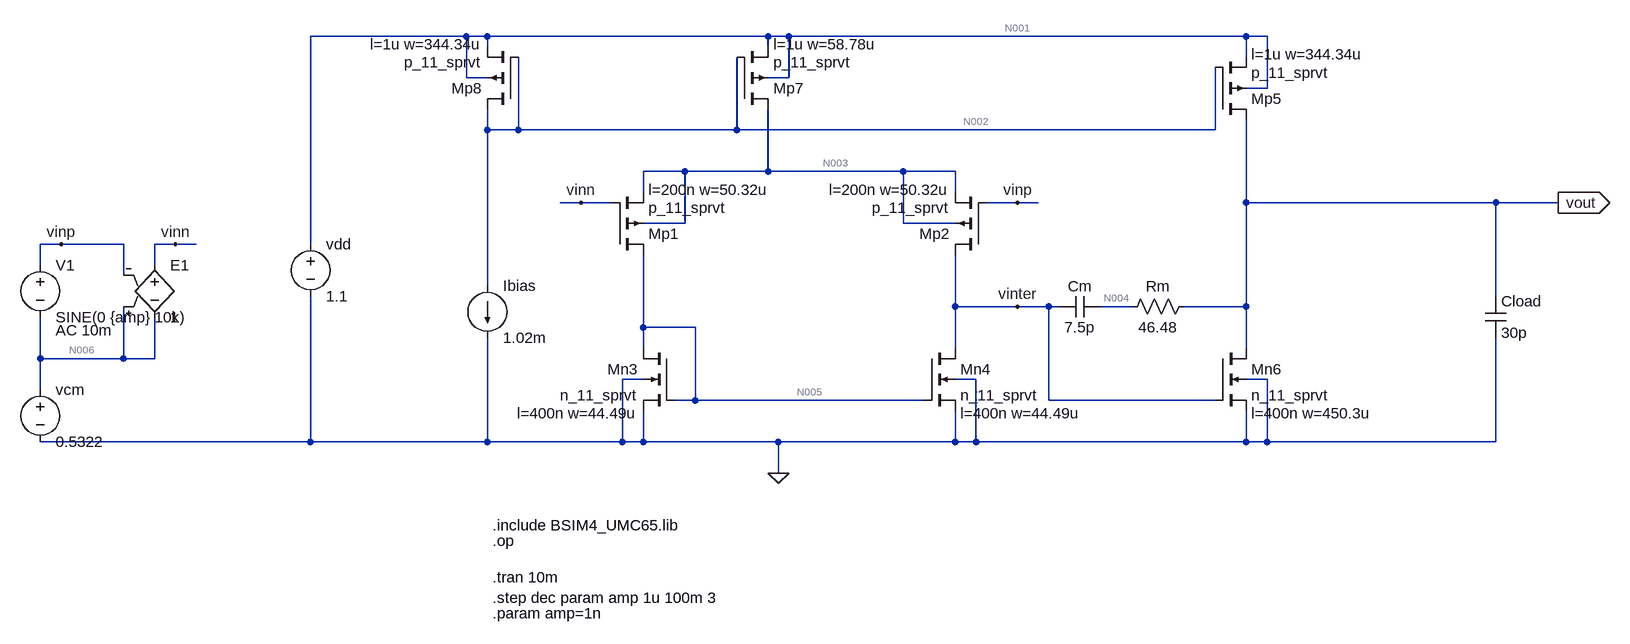
[diagram p0: schematic final_project_pss.asc]
final_project_pss.asc, the LTspice schematic file:
Version 4
SHEET 1 4000 1432
WIRE 2208 528 1968 528
WIRE 2240 528 2208 528
WIRE 2672 528 2240 528
WIRE 2704 528 2672 528
WIRE 3408 528 2704 528
WIRE 3440 528 3408 528
WIRE 2240 544 2240 528
WIRE 2672 544 2672 528
WIRE 3408 560 3408 528
WIRE 2208 592 2208 528
WIRE 2240 592 2208 592
WIRE 2704 592 2704 528
WIRE 2704 592 2672 592
WIRE 3440 608 3440 528
WIRE 3440 608 3408 608
WIRE 2240 672 2240 640
WIRE 2288 672 2288 560
WIRE 2288 672 2240 672
WIRE 2624 672 2624 560
WIRE 2624 672 2288 672
WIRE 3360 672 3360 576
WIRE 3360 672 2624 672
WIRE 2544 736 2480 736
WIRE 2672 736 2672 640
WIRE 2672 736 2544 736
WIRE 2880 736 2672 736
WIRE 2960 736 2880 736
WIRE 2480 768 2480 736
WIRE 2960 768 2960 736
WIRE 2384 784 2352 784
WIRE 2432 784 2384 784
WIRE 3056 784 3008 784
WIRE 3088 784 3056 784
WIRE 3408 784 3408 656
WIRE 3792 784 3408 784
WIRE 3888 784 3792 784
WIRE 2544 816 2544 736
WIRE 2544 816 2480 816
WIRE 2880 816 2880 736
WIRE 2960 816 2880 816
WIRE 1584 848 1552 848
WIRE 1680 848 1584 848
WIRE 1760 848 1728 848
WIRE 1792 848 1760 848
WIRE 1968 848 1968 528
WIRE 1552 880 1552 848
WIRE 1728 880 1728 848
WIRE 1680 896 1680 848
WIRE 2240 912 2240 672
WIRE 3792 928 3792 784
WIRE 2960 944 2960 864
WIRE 3056 944 2960 944
WIRE 3104 944 3056 944
WIRE 3120 944 3104 944
WIRE 3232 944 3184 944
WIRE 3408 944 3408 784
WIRE 3408 944 3312 944
WIRE 2480 976 2480 864
WIRE 2560 976 2480 976
WIRE 2480 1008 2480 976
WIRE 2960 1008 2960 944
WIRE 3408 1008 3408 944
WIRE 1552 1024 1552 960
WIRE 1680 1024 1680 944
WIRE 1680 1024 1552 1024
WIRE 1728 1024 1728 960
WIRE 1728 1024 1680 1024
WIRE 2480 1056 2448 1056
WIRE 2992 1056 2960 1056
WIRE 3440 1056 3408 1056
WIRE 1552 1072 1552 1024
WIRE 2560 1088 2560 976
WIRE 2560 1088 2528 1088
WIRE 2912 1088 2560 1088
WIRE 3104 1088 3104 944
WIRE 3360 1088 3104 1088
WIRE 1968 1152 1968 928
WIRE 1968 1152 1552 1152
WIRE 2240 1152 2240 992
WIRE 2240 1152 1968 1152
WIRE 2448 1152 2448 1056
WIRE 2448 1152 2240 1152
WIRE 2480 1152 2480 1104
WIRE 2480 1152 2448 1152
WIRE 2688 1152 2480 1152
WIRE 2960 1152 2960 1104
WIRE 2960 1152 2688 1152
WIRE 2992 1152 2992 1056
WIRE 2992 1152 2960 1152
WIRE 3408 1152 3408 1104
WIRE 3408 1152 2992 1152
WIRE 3440 1152 3440 1056
WIRE 3440 1152 3408 1152
WIRE 3792 1152 3792 992
WIRE 3792 1152 3440 1152
WIRE 2688 1200 2688 1152
FLAG 3888 784 vout
IOPIN 3888 784 Out
FLAG 1584 848 vinp
FLAG 1760 848 vinn
FLAG 2688 1200 0
FLAG 3056 784 vinp
FLAG 2384 784 vinn
FLAG 3056 944 vinter
SYMBOL voltage 1968 832 R0
WINDOW 123 0 0 Left 0
WINDOW 39 0 0 Left 0
SYMATTR InstName vdd
SYMATTR Value 1.1
SYMBOL voltage 1552 1056 R0
WINDOW 123 24 124 Left 2
WINDOW 39 0 0 Left 0
SYMATTR InstName vcm
SYMATTR Value 0.5322
SYMBOL e2 1728 864 R0
SYMATTR InstName E1
SYMATTR Value 1
SYMBOL voltage 1552 864 R0
WINDOW 123 24 116 Left 2
WINDOW 39 0 0 Left 0
SYMATTR Value2 AC 10m
SYMATTR InstName V1
SYMATTR Value SINE(0 {amp} 10k)
SYMBOL pmos4 2288 640 R180
WINDOW 123 56 100 Left 2
SYMATTR Value2 l=1u w=344.34u
SYMATTR InstName Mp8
SYMATTR Value p_11_sprvt
SYMBOL pmos4 2624 640 M180
WINDOW 123 56 100 Left 2
SYMATTR Value2 l=1u w=58.78u
SYMATTR InstName Mp7
SYMATTR Value p_11_sprvt
SYMBOL pmos4 2432 864 M180
WINDOW 123 56 100 Left 2
SYMATTR Value2 l=200n w=50.32u
SYMATTR InstName Mp1
SYMATTR Value p_11_sprvt
SYMBOL pmos4 3008 864 R180
WINDOW 123 56 100 Left 2
SYMATTR Value2 l=200n w=50.32u
SYMATTR InstName Mp2
SYMATTR Value p_11_sprvt
SYMBOL nmos4 2912 1008 R0
WINDOW 123 56 100 Left 2
SYMATTR Value2 l=400n w=44.49u
SYMATTR InstName Mn4
SYMATTR Value n_11_sprvt
SYMBOL nmos4 2528 1008 M0
WINDOW 123 56 100 Left 2
SYMATTR Value2 l=400n w=44.49u
SYMATTR InstName Mn3
SYMATTR Value n_11_sprvt
SYMBOL nmos4 3360 1008 R0
WINDOW 123 56 100 Left 2
SYMATTR Value2 l=400n w=450.3u
SYMATTR InstName Mn6
SYMATTR Value n_11_sprvt
SYMBOL pmos4 3360 656 M180
WINDOW 123 56 100 Left 2
SYMATTR Value2 l=1u w=344.34u
SYMATTR InstName Mp5
SYMATTR Value p_11_sprvt
SYMBOL res 3328 928 R90
WINDOW 0 0 56 VBottom 2
WINDOW 3 32 56 VTop 2
SYMATTR InstName Rm
SYMATTR Value 46.48
SYMBOL cap 3184 928 R90
WINDOW 0 0 32 VBottom 2
WINDOW 3 32 32 VTop 2
SYMATTR InstName Cm
SYMATTR Value 7.5p
SYMBOL current 2240 912 R0
WINDOW 123 0 0 Left 0
WINDOW 39 0 0 Left 0
SYMATTR InstName Ibias
SYMATTR Value 1.02m
SYMBOL cap 3776 928 R0
SYMATTR InstName Cload
SYMATTR Value 30p
TEXT 2248 1280 Left 2 !.include BSIM4_UMC65.lib
TEXT 2248 1304 Left 2 !.op
TEXT 2248 1360 Left 2 !.tran 10m
TEXT 2248 1392 Left 2 !.step dec param amp 1u 100m 3
TEXT 2248 1416 Left 2 !.param amp=1n

The netlist it stands for:
* final_project_pss.asc
vdd N001 0 1.1
vcm N006 0 0.5322
E1 vinn N006 N006 vinp 1
V1 vinp N006 SINE(0 {amp} 10k) AC 10m
Mp8 N002 N002 N001 N001 p_11_sprvt l=1u w=344.34u
Mp7 N003 N002 N001 N001 p_11_sprvt l=1u w=58.78u
Mp1 N005 vinn N003 N003 p_11_sprvt l=200n w=50.32u
Mp2 vinter vinp N003 N003 p_11_sprvt l=200n w=50.32u
Mn4 vinter N005 0 0 n_11_sprvt l=400n w=44.49u
Mn3 N005 N005 0 0 n_11_sprvt l=400n w=44.49u
Mn6 vout vinter 0 0 n_11_sprvt l=400n w=450.3u
Mp5 vout N002 N001 N001 p_11_sprvt l=1u w=344.34u
Rm vout N004 46.48
Cm N004 vinter 7.5p
Ibias N002 0 1.02m
Cload vout 0 30p
.model NMOS NMOS
.model PMOS PMOS
.lib standard.mos
.include BSIM4_UMC65.lib
.op
.tran 10m
.step dec param amp 1u 100m 3
.param amp=1n
.backanno
.end

* Results of the author's LTspice run, read from the files saved beside the schematic
* Operating Point (first step), zero values left out:
*   amp = 1 µ
*   V(n001) = 1.1 V
*   V(n006) = 532.2 mV
*   V(vinn) = 532.2 mV
*   V(vinp) = 532.2 mV
*   V(n002) = 693 mV
*   V(n003) = 814 mV
*   V(n005) = 222.6 mV
*   V(vinter) = 222 mV
*   V(vout) = 605.1 mV
*   V(n004) = 605.1 mV
*   Id(Mn6) = 1.043 mA
*   Ig(Mn6) = 76.43 nA
*   Is(Mn6) = -1.044 mA
*   Id(Mn3) = 82.44 µA
*   Ig(Mn3) = 8.797 nA
*   Is(Mn3) = -82.45 µA
*   Id(Mn4) = 82.4 µA
*   Ig(Mn4) = 8.798 nA
*   Is(Mn4) = -82.41 µA
*   Id(Mp5) = -1.043 mA
*   Ig(Mp5) = -398.1 nA
*   Ib(Mp5) = 215.1 pA
*   Is(Mp5) = 1.044 mA
*   Id(Mp2) = -82.48 µA
*   Ig(Mp2) = -3.56 nA
*   Ib(Mp2) = 8.808 pA
*   Is(Mp2) = 82.48 µA
*   Id(Mp1) = -82.46 µA
*   Ig(Mp1) = -3.561 nA
*   Ib(Mp1) = 8.808 pA
*   Is(Mp1) = 82.46 µA
*   Id(Mp7) = -164.9 µA
*   Ig(Mp7) = -69.55 nA
*   Ib(Mp7) = 36.94 pA
*   Is(Mp7) = 165 µA
*   Id(Mp8) = -1.019 mA
*   Ig(Mp8) = -400.8 nA
*   Ib(Mp8) = 215 pA
*   Is(Mp8) = 1.02 mA
*   I(Ibias) = 1.02 mA
*   I(E1) = 3.561 nA
*   I(V1) = 3.56 nA
*   I(Vcm) = 7.121 nA
*   I(Vdd) = -2.228 mA